# EAGLE design md modularf (EAGLE 9.6.2)
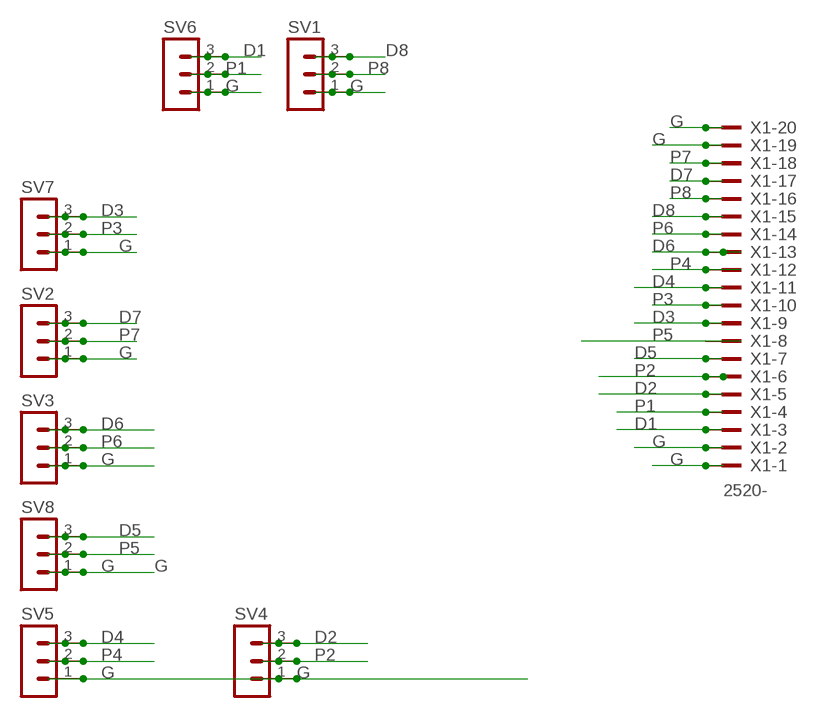
[diagram p0: schematic, sheet 1]

## Parts
SV1  MA03-1  [MA03-1]
SV2  MA03-1  [MA03-1]
SV3  MA03-1  [MA03-1]
SV4  MA03-1  [MA03-1]
SV5  MA03-1  [MA03-1]
SV6  MA03-1  [MA03-1]
SV7  MA03-1  [MA03-1]
SV8  MA03-1  [MA03-1]
X1  2520-  [PAK100/2500-20]

## Nets
D1: SV6.3 X1.3
D2: SV4.3 X1.5
D3: SV7.3 X1.9
D4: SV5.3 X1.11
D5: SV8.3 X1.7
D6: SV3.3 X1.13
D7: SV2.3 X1.17
D8: SV1.3 X1.15
G: SV1.1 SV2.1 SV3.1 SV4.1 SV5.1 SV6.1 SV7.1 SV8.1 X1.1 X1.2 X1.19 X1.20
P1: SV6.2 X1.4
P2: SV4.2 X1.6
P3: SV7.2 X1.10
P4: SV5.2 X1.12
P5: SV8.2 X1.8
P6: SV3.2 X1.14
P7: SV2.2 X1.18
P8: SV1.2 X1.16

## Library data of the parts
SV1-SV8 = con-lstb:MA03-1: PIN HEADER; OC_FARNELL: unknown; OC_NEWARK: unknown
X1 = con-3m:2520-: 3M (TM) Pak 100 4-Wall Header Source: 3M; OC_FARNELL: unknown; OC_NEWARK: unknown

## Board
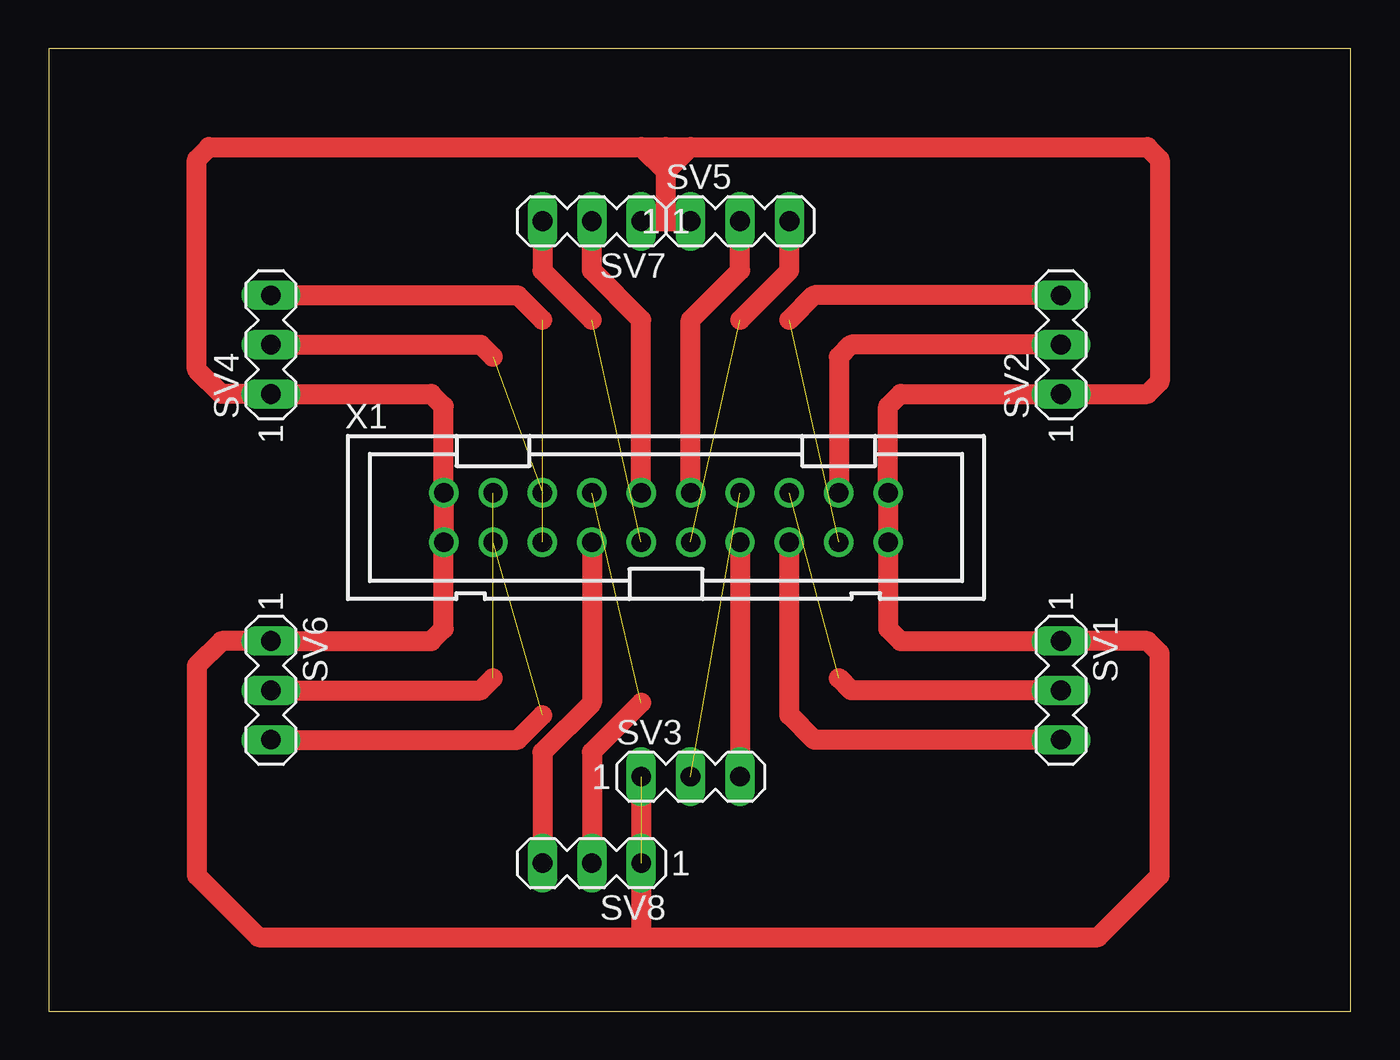
[diagram p1: board, top side]

Size 66.98 x 49.52 mm. Coordinates in mm from the lower left corner, seen from the top.
Outline: 0,0 66.98,0 66.98,49.52 0,49.52 0,0
Copper layers (1*16): Top 0.035mm / dielectric 1.5mm / Bottom 0.035mm
Design rules "default": minimum track width 6mil, minimum drill 0.35mm, track to track 6mil, track to pad 6mil, pad to pad 6mil, via to via 6mil, smd to smd 6mil, copper to edge 40mil, drill to drill 6mil, minimum pad ring 10mil, minimum via ring 8mil, stop-mask expansion 4mil, vias tented up to drill 0mil, thermal gap 10mil

### Footprints (pad centres in the part's own frame; a part is rotated, then mirrored left to right if it is on the bottom)
MA03-1 = drill 1.016 long: 1 -2.54,0; 2 0,0; 3 2.54,0
PAK100/2500-20 = drill 1 pad 1.422: 1 -11.43,-1.27; 2 -11.43,1.27; 3 -8.89,-1.27; 4 -8.89,1.27; 5 -6.35,-1.27; 6 -6.35,1.27; 7 -3.81,-1.27; 8 -3.81,1.27; 9 -1.27,-1.27; 10 -1.27,1.27; 11 1.27,-1.27; 12 1.27,1.27; 13 3.81,-1.27; 14 3.81,1.27; 15 6.35,-1.27; 16 6.35,1.27; 17 8.89,-1.27; 18 8.89,1.27; 19 11.43,-1.27; 20 11.43,1.27

### Placement (x,y rotation side)
SV1  52.07,16.51 270 top
SV2  52.07,34.29 90 top
SV3  33.02,12.06 0 top
SV4  11.43,34.29 90 top
SV5  35.56,40.64 0 top
SV6  11.43,16.51 270 top
SV7  27.94,40.64 180 top
SV8  27.94,7.62 180 top
X1  31.75,25.4 0 top

### Tracks (layer width: path | path; a pad name or v marks a point on that pad's centre or on a via)
D1  (1 unrouted)
  Top 1.016: 25.4,15.24 24.13,13.97 SV6.3
D2  (1 unrouted)
  Top 1.016: SV4.3 24.13,36.83 25.4,35.56
D3  (1 unrouted)
  Top 1.016: SV7.3 25.4,38.1 27.94,35.56
D4  (1 unrouted)
  Top 1.016: 35.56,35.56 38.1,38.1 SV5.3
D5
  Top 1.016: SV8.3 25.4,13.33 27.94,15.88 X1.7
D6
  Top 1.016: X1.13 SV3.3
D7  (1 unrouted)
  Top 1.016: SV2.3 39.37,36.83 38.1,35.56
D8
  Top 1.016: SV1.3 39.37,13.97 38.1,15.24 X1.15
G  (1 unrouted)
  Top 1.016: SV7.1 31.75,40.64 | 31.75,40.64 SV5.1 | 31.75,40.64 31.75,43.18 | 30.48,44.45 8.26,44.45 7.62,43.82 7.62,33.02 8.89,31.75 SV4.1 19.69,31.75 20.32,31.11 X1.2 X1.1 20.32,19.68 19.69,19.05 SV6.1 8.89,19.05 7.62,17.78 7.62,6.99 10.79,3.81 30.48,3.81 | 30.48,44.45 31.75,44.45 | 31.75,44.45 33.02,44.45 | 33.02,44.45 56.52,44.45 57.15,43.82 57.15,32.39 56.52,31.75 SV2.1 43.81,31.75 43.18,31.11 X1.20 X1.19 43.18,19.68 43.81,19.05 SV1.1 56.52,19.05 57.15,18.41 57.15,6.99 53.97,3.81 30.48,3.81 | 30.48,44.45 31.75,43.18 | 31.75,43.18 33.02,44.45 | 31.75,43.18 31.75,44.45 | SV3.1 30.48,3.81
P1  (1 unrouted)
  Top 1.016: 22.86,17.14 22.23,16.51 SV6.2
P2  (1 unrouted)
  Top 1.016: SV4.2 22.23,34.29 22.86,33.66
P3
  Top 1.016: SV7.2 27.94,38.1 30.48,35.56 X1.10
P4
  Top 1.016: SV5.2 35.56,38.1 33.02,35.56 X1.12
P5  (1 unrouted)
  Top 1.016: 30.48,15.88 27.94,13.33 SV8.2
P6  (1 unrouted)
P7
  Top 1.016: SV2.2 41.27,34.29 40.64,33.66 X1.18
P8  (1 unrouted)
  Top 1.016: SV1.2 41.27,16.51 40.64,17.14